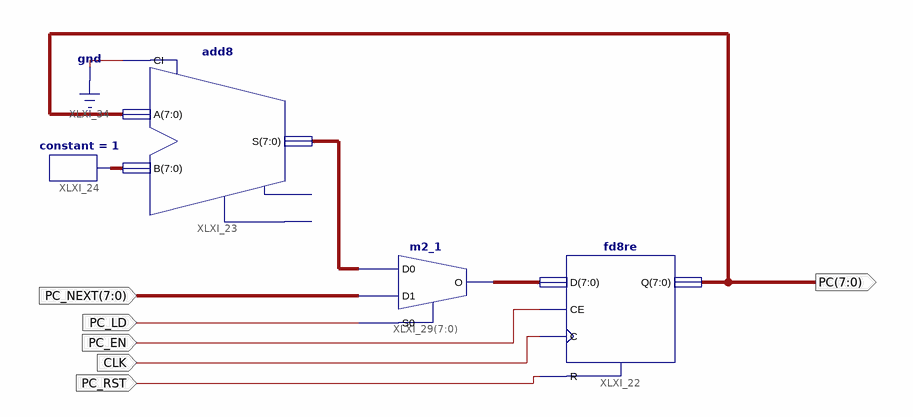
[diagram p0: schematic sheet 1]
// Xilinx ISE schematic program_counter.sch (spartan6) as structural Verilog: 4 symbols, 6 ports
module program_counter (
  input  PC_RST,
  input  PC_EN,
  input  CLK,
  input  PC_LD,
  input  [7:0] PC_NEXT,
  output [7:0] PC
);

  wire [7:0] XLXN_20, XLXN_25, XLXN_27;

  add8 XLXI_23 (.A(PC), .B(XLXN_27), .CI(1'b0), .S(XLXN_25));  // open: CO, OFL
  constant #(.CValue("1")) XLXI_24 (.O(XLXN_27));
  m2_1 XLXI_29[7:0] (.D0(XLXN_25), .D1(PC_NEXT), .S0(PC_LD), .O(XLXN_20));
  fd8re XLXI_22 (.C(CLK), .CE(PC_EN), .D(XLXN_20), .R(PC_RST), .Q(PC));
endmodule
